# EasyEDA schematic SCH_REV1.3_2024-02-19.json
TITLE: Sheet_1; REV: 1.0; Date: 2024-02-18; Sheet: 1/1; Drawn By: liquid_soul; Company: Your Company
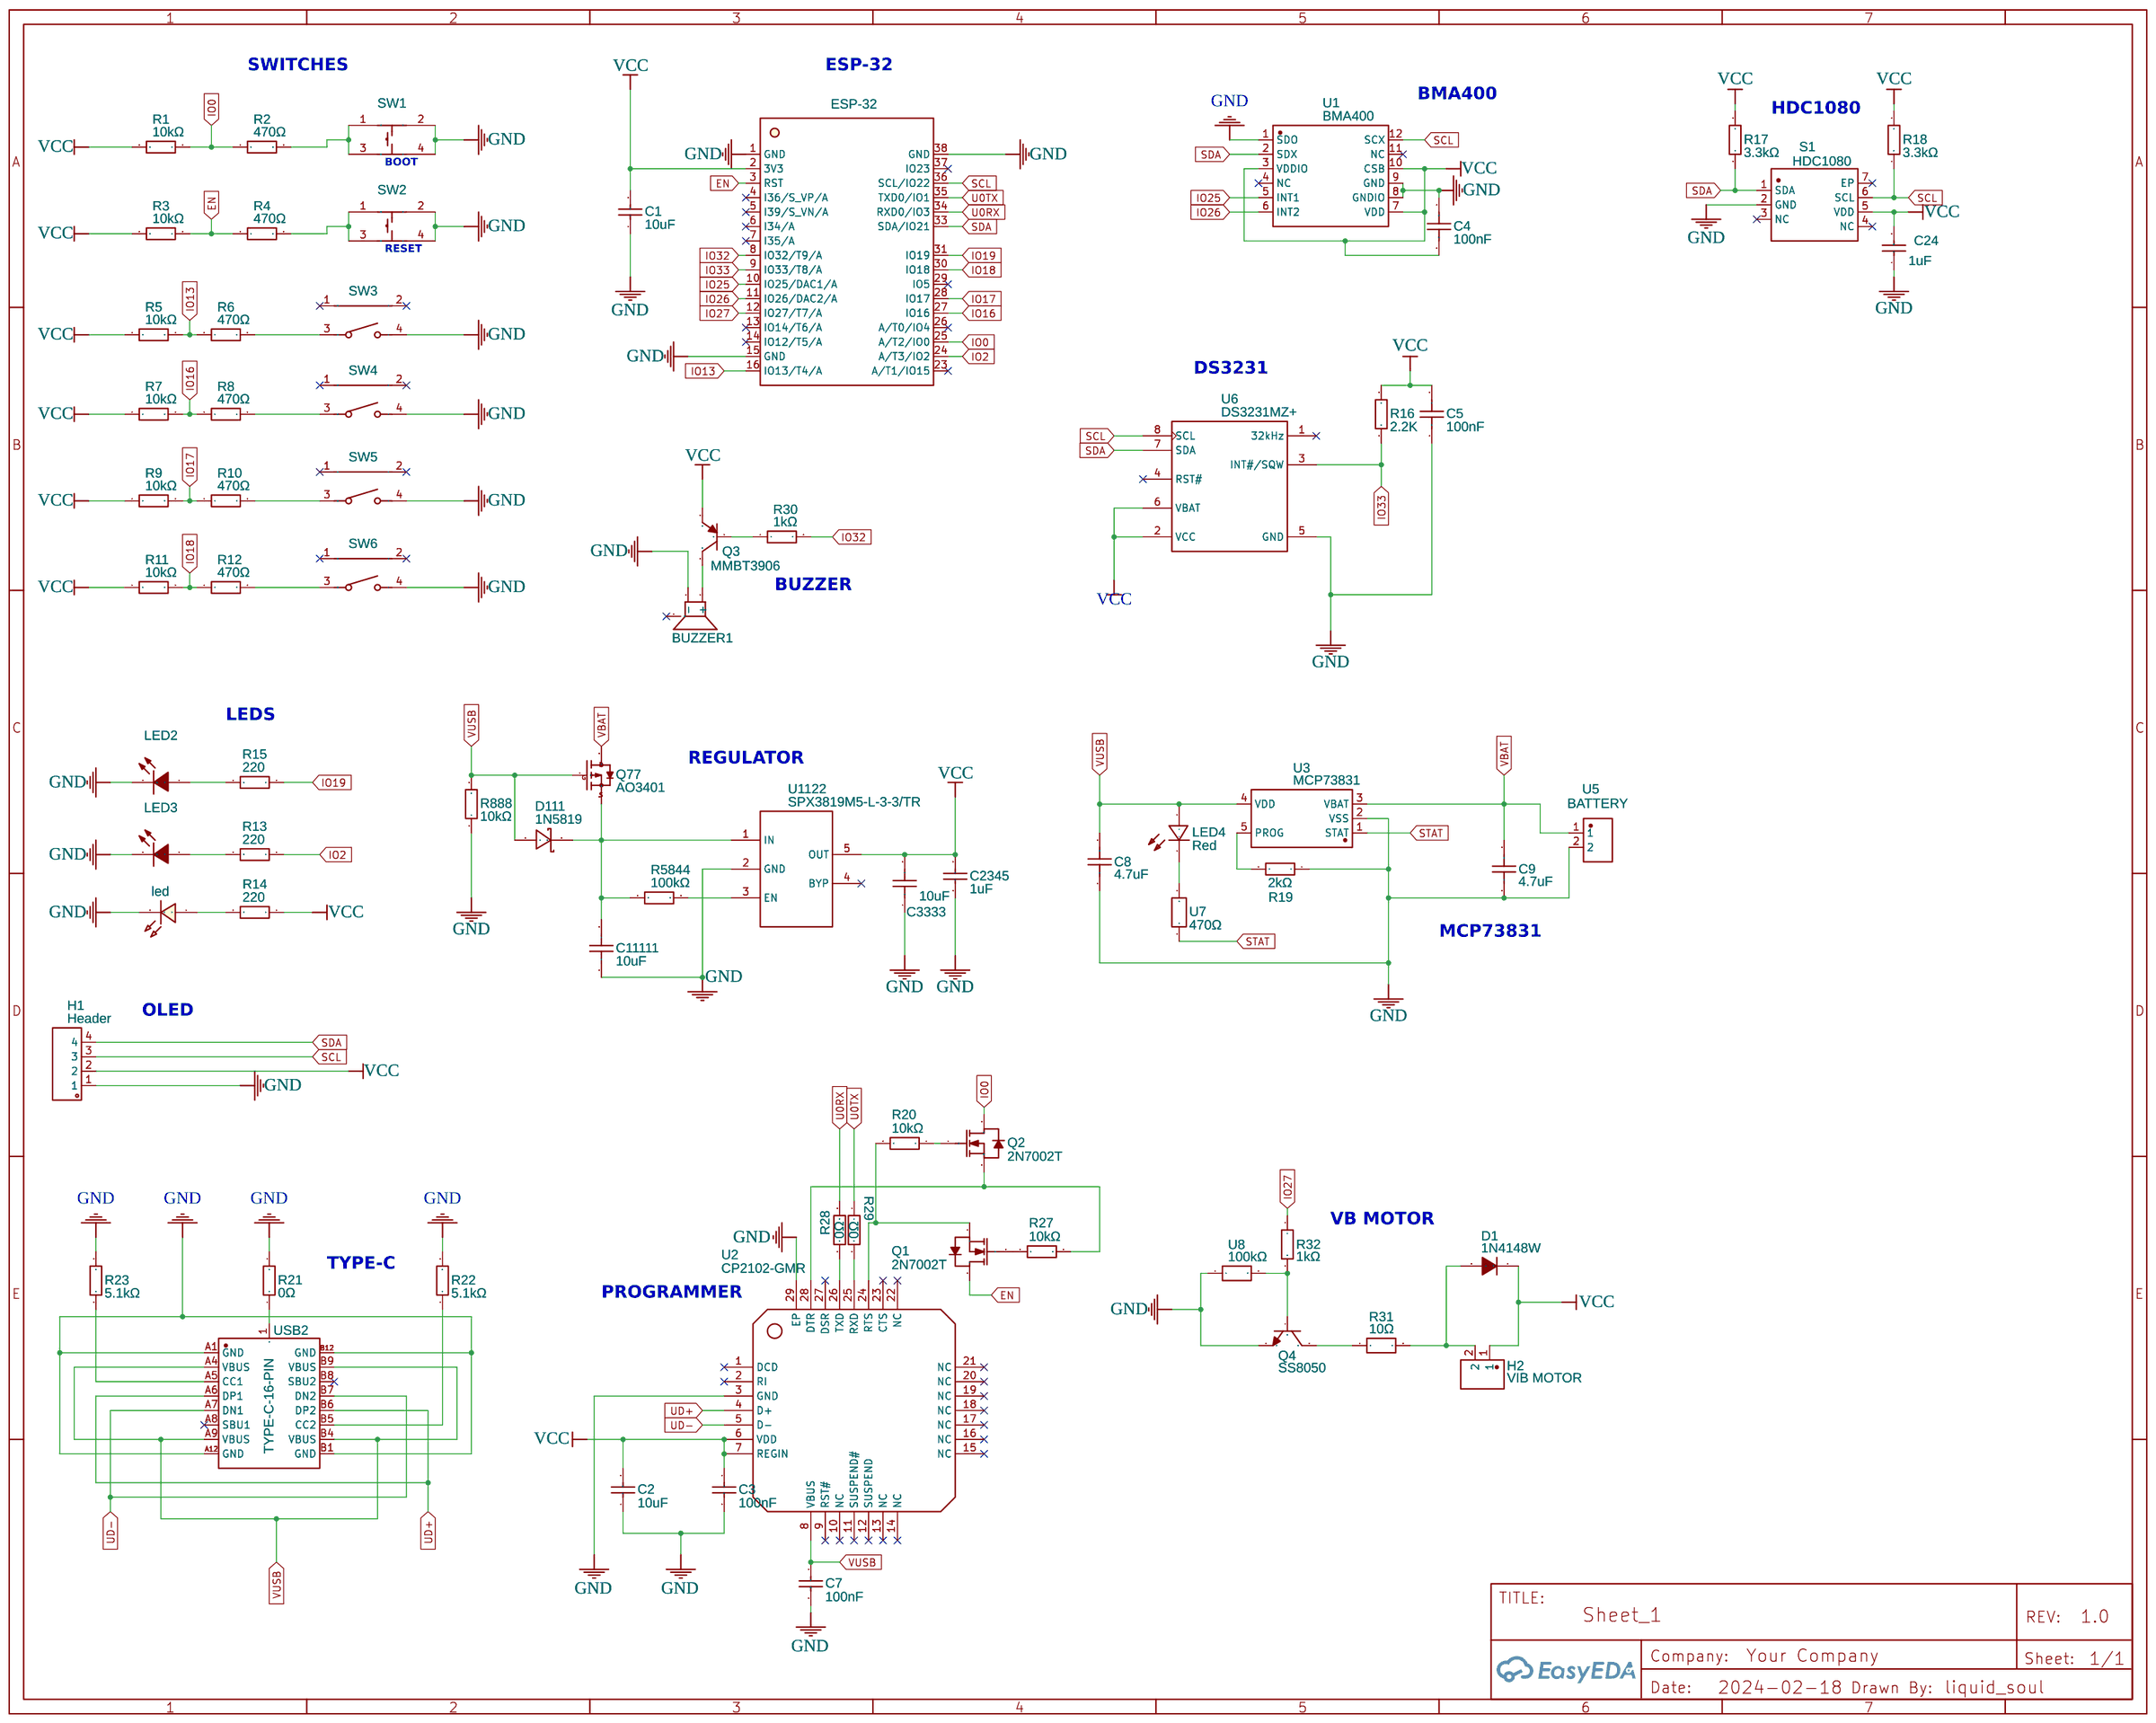
[diagram p0: schematic sheet]

## Parts
BUZZER1  4000Hz  [BUZ-SMD_3P-L5.2-W5.2-P3.50-BR]
C1  10uF  [C0603]
C2  10uF  [C0603]
C3  100nF  [C0603]
C4  100nF  [C0603]
C5  100nF  [C0603]
C7  100nF  [C0603]
C8  4.7uF  [C0603]
C9  4.7uF  [C0603]
C24  1uF  [C0603]
C2345  1uF  [C0603]
C3333  10uF  [C0603]
C11111  10uF  [C0603]
D1  1N4148W  [SOD-123_L2.8-W1.8-LS3.7-RD]
D111  1N5819  [SOD-123F_L2.8-W1.8-LS3.7-RD]
H1  Header  [HDR-TH_4P-P2.54-V-M]
H2  VIB MOTOR  [HDR-TH_2P-P2.54-V-M-1]
LED1  led  [LED0603_RED]
LED2  D-B060306B1-KS2  [LED0603-RD]
LED3  D-B060306B1-KS2  [LED0603-RD]
LED4  Red  [LED0603-RD]
Q1  2N7002T  [SOT-523-3_L1.6-W0.8-P0.50-LS1.6-BR]
Q2  2N7002T  [SOT-523-3_L1.6-W0.8-P0.50-LS1.6-BR]
Q3  MMBT3906  [SOT-23-3_L2.9-W1.4-P1.91-LS2.6-BR]
Q4  SS8050  [SOT-23-3_L2.9-W1.3-P1.90-LS2.4-BR]
Q77  AO3401  [SOT-23-3_L2.9-W1.3-P1.90-LS2.4-BR]
R1  10kΩ  [R0603]
R2  470Ω  [R0603]
R3  10kΩ  [R0603]
R4  470Ω  [R0603]
R5  10kΩ  [R0603]
R6  470Ω  [R0603]
R7  10kΩ  [R0603]
R8  470Ω  [R0603]
R9  10kΩ  [R0603]
R10  470Ω  [R0603]
R11  10kΩ  [R0603]
R12  470Ω  [R0603]
R13  220  [R0603]
R14  220  [R0603]
R15  220  [R0603]
R16  2.2K  [R0603]
R17  3.3kΩ  [R0603]
R18  3.3kΩ  [R0603]
R19  2kΩ  [R0603]
R20  10kΩ  [R0603]
R21  0Ω  [R0603]
R22  5.1kΩ  [R0603]
R23  5.1kΩ  [R0603]
R27  10kΩ  [R0603]
R28  0Ω  [R0603]
R29  0Ω  [R0603]
R30  1kΩ  [R0603]
R31  10Ω  [R0603]
R32  1kΩ  [R0603]
R888  10kΩ  [R0603]
R5844  100kΩ  [R0603]
S1  HDC1080  [SENSOR-SMD_HDC1080DMBR]
SW1  SKRPACE010  [KEY-SMD_4P-L4.2-W3.2-P2.20-LS4.6]
SW2  SKRPACE010  [KEY-SMD_4P-L4.2-W3.2-P2.20-LS4.6]
SW3  TS24CA  [SW-SMD_TS24CA]
SW4  TS24CA  [SW-SMD_TS24CA]
SW5  TS24CA  [SW-SMD_TS24CA]
SW6  TS24CA  [SW-SMD_TS24CA]
U1  BMA400  [LGA-12_L2.0-W2.0-P0.50-BL]
U2  CP2102-GMR  [WQFN-28_L5.0-W5.0-P0.50-BL-EP3.2]
U3  MCP73831  [SOT-23-5_L2.9-W1.6-P0.95-LS2.8-BL]
U4  ESP-32  [ESP-32]
U5  BATTERY  [HDR-TH_2P-P2.54-V-F]
U6  DS3231MZ+  [SOIC-8_L4.9-W3.9-P1.27-LS6.0-BL]
U7  470Ω  [R0603]
U8  100kΩ  [R0603]
U1122  SPX3819M5-L-3-3/TR  [SOT-23-5_L3.0-W1.7-P0.95-LS2.8-BR]
USB2  TYPE-C-16-PIN  [TYPE-C-SMD_TYPE-CF3.1]

## Library data of the parts
BUZZER1 = MLT-5030: Supplier: LCSC; Manufacturer: 华能; Supplier Part: C95297; JLCPCB Part Class: Extended Part
C1 C2 = 0603F106M160NT: Supplier: LCSC; Manufacturer: FH; Supplier Part: C48906; JLCPCB Part Class: Extended Part
C3 C7 = FN18X104K500PBG: Supplier: LCSC; Supplier Part: C235731; Manufacturer: Prosperity Dielectrics; Contributor: LCSC; JLCPCB Part Class: Extended Part
C4 C5 = 06033C104K4T2A: Contributor: LCSC; Supplier: LCSC; Supplier Part: C597114; Manufacturer: Kyocera AVX; JLCPCB Part Class: Extended Part
C8 C9 = CC0603KRX5R8BB475: Supplier: LCSC; Supplier Part: C326580; Manufacturer: YAGEO(国巨); Contributor: LCSC; JLCPCB Part Class: Extended Part
C24 C2345 = 0603B105K250NT: Supplier: LCSC; Manufacturer: FH; Supplier Part: C59302; JLCPCB Part Class: Extended Part
C3333 C11111 = 0603X106M250NT: Supplier: LCSC; Supplier Part: C479655; Manufacturer: FH(Guangdong Fenghua Advanced Tech); Contributor: LCSC; JLCPCB Part Class: Extended Part
D1 = 1N4148W-C84367: Supplier: LCSC; Manufacturer: MDD; Supplier Part: C84367; JLCPCB Part Class: Extended Part
D111 = 1N5819W: Supplier: LCSC; Supplier Part: C169540; Manufacturer: Shandong Jingdao Microelectronics; Contributor: LCSC; JLCPCB Part Class: Extended Part
H1 = Header-Male-2.54_1x4_C59481: Supplier: LCSC; Manufacturer: ReliaPro; Manufacturer Part: Headers  Pins 1*4P; Supplier Part: C59481
H2 = 77311-118-02LF: Contributor: LCSC; Supplier: LCSC; Supplier Part: C599036; Manufacturer: Amphenol; JLCPCB Part Class: Extended Part
LED1 = LED-0603_R: Manufacturer: EVERLIGHT(台湾亿光); Manufacturer Part: 19-217/R6C-AL1M2VY/3T; Supplier Part: C72044; Supplier: LCSC; Contributor: LCEDA_01
LED2 LED3 = D-B060306B1-KS2: Contributor: LCSC; Supplier: LCSC; Supplier Part: C118339; Manufacturer: ARKLED(方舟); Manufacturer Part: D-060306B1; JLCPCB Part Class: Extended Part
LED4 = E6Q0603URAC1UDA: Supplier: LCSC; Supplier Part: C375573; Manufacturer: ekinglux(亿晶源); Contributor: LCSC; JLCPCB Part Class: Extended Part
Q1 Q2 = K2N7002T-7-F: Supplier: LCSC; Supplier Part: C2904827; Manufacturer: KUU; Contributor: LCSC
Q3 = MMBT3906_C2891809: Contributor: LCSC; Supplier: LCSC; Supplier Part: C2891809; Manufacturer: YONGYUTAI(永裕泰); JLCPCB Part Class: Extended Part
Q4 = SS8050_C916392: Contributor: LCSC; Supplier: LCSC; Supplier Part: C916392; Manufacturer: JSMSEMI(杰盛微); JLCPCB Part Class: Extended Part
Q77 = AO3401: Supplier: LCSC; Manufacturer: Hottech; Contributor: LCSC; Supplier Part: C181091
R1 R3 R5 R7 R9 R11 R20 R27 = SY0603JN10KP: Supplier: LCSC; Supplier Part: C380762; Manufacturer: SANYEAR; Resistance (Ohms): 10K; Contributor: LCSC; JLCPCB Part Class: Extended Part
R2 R4 R6 R8 R10 R12 = QR0603F470RP05: Supplier: LCSC; Supplier Part: C176130; Manufacturer: Ever Ohms Tech; Resistance (Ohms): 470; Contributor: LCSC; JLCPCB Part Class: Extended Part
R13-R15 = AF0603FR-07220RL: Supplier: LCSC; Supplier Part: C144094; Manufacturer: YAGEO; Contributor: LCSC; JLCPCB Part Class: Extended Part; Resistance: 220Ω
R16 = RMC06032.2K1%N: Contributor: LCSC; Supplier: LCSC; Supplier Part: C325591; Manufacturer: Tyohm(幸亚电阻); JLCPCB Part Class: Extended Part
R17 R18 = RMC06033.3K5%N: Contributor: LCSC; Supplier: LCSC; Supplier Part: C269691; Manufacturer: Tyohm(幸亚电阻); JLCPCB Part Class: Extended Part
R19 = RMC06032K5%N: Supplier: LCSC; Supplier Part: C269690; Manufacturer: Tyohm(幸亚电阻); Manufacturer Part: RMC 0603 2K J N; Resistance (Ohms): 2K; Contributor: LCSC; JLCPCB Part Class: Extended Part
R21 R28 R29 = ETCR0603F0000K9: Supplier: LCSC; Supplier Part: C365490; Manufacturer: ResistorToday; Resistance (Ohms): 0; Contributor: LCSC; JLCPCB Part Class: Extended Part
R22 R23 = RMC06035.1K1%N: Supplier: LCSC; Supplier Part: C269716; Manufacturer: Tyohm; Resistance (Ohms): 5.1K; Contributor: LCSC; JLCPCB Part Class: Extended Part
R30 = 0603WAF1001T5E: Supplier: LCSC; Manufacturer: UNI-ROYAL(厚声); Supplier Part: C21190; JLCPCB Part Class: Basic Part
R31 = CR-03JL7---10R: Contributor: LCSC; Supplier: LCSC; Supplier Part: C217283; Manufacturer: Viking(光颉); JLCPCB Part Class: Extended Part
R32 = RMC06031K5%N: Contributor: LCSC; Supplier: LCSC; Supplier Part: C269685; Manufacturer: Tyohm(幸亚电阻); JLCPCB Part Class: Extended Part
R888 = RMC060310K1%N: Supplier: LCSC; Supplier Part: C269701; Manufacturer: Tyohm; Resistance (Ohms): 10K; Contributor: LCSC; JLCPCB Part Class: Extended Part
R5844 = RMC0603100K1%N: Supplier: LCSC; Supplier Part: C269699; Manufacturer: Tyohm; Resistance (Ohms): 100K; Contributor: LCSC; JLCPCB Part Class: Extended Part
S1 = HDC1080DMBR: Supplier: LCSC; Manufacturer: TI(德州仪器); Supplier Part: C82227; JLCPCB Part Class: Extended Part
SW1 SW2 = SKRPACE010: Contributor: LCSC; Supplier: LCSC; Manufacturer: ALPSALPINE(阿尔卑斯阿尔派); Supplier Part: C139797; JLCPCB Part Class: Extended Part
SW3-SW6 = TS24CA: Contributor: LCSC; Supplier: LCSC; Supplier Part: C393942; Manufacturer: SHOU HAN(首韩); JLCPCB Part Class: Extended Part
U1 = BMA400: Contributor: LCSC; Supplier: LCSC; Supplier Part: C437655; Manufacturer: Bosch(博世); JLCPCB Part Class: Extended Part
U2 = CP2102-GMR: Supplier: LCSC; Manufacturer: SILICON LABS; Supplier Part: C6568; JLCPCB Part Class: Basic Part
U3 = MCP73831T-2DCI/OT: Supplier: LCSC; Supplier Part: C625597; Manufacturer: MICROCHIP(美国微芯); Contributor: LCSC; JLCPCB Part Class: Extended Part
U4 = 安信可ESP-32S: Supplier: LCSC; Supplier Part: C82899; Manufacturer: Ai-Thinker; Manufacturer Part: ESP-32S; Contributor: Fangbrbr
U5 = KH-2.54FH-1X2P-H8.5: Supplier: LCSC; Supplier Part: C2905414; Manufacturer: kinghelm(金航标); Contributor: LCSC
U6 = DS3231MZ+: Supplier: LCSC; Manufacturer: ADI(亚德诺)/MAXIM(美信); Manufacturer Part: DS3231MZ+TRL; Supplier Part: C107410; JLCPCB Part Class: Extended Part
U7 = SCR0603F470R: Supplier: LCSC; Supplier Part: C5140094; Manufacturer: VO(翔胜); link: https://atta.szlcsc.com/upload/public/pdf/source/20220823/E5DDB4243192CD3C8AE9677163F934FF.pdf; Contributor: lcsc
U8 = SCR0603F100K: Contributor: lcsc; Supplier: LCSC; Supplier Part: C3016388; Manufacturer: VO(翔胜); JLCPCB Part Class: Extended Part
U1122 = SPX3819M5-L-3-3/TR: Supplier: LCSC; Manufacturer: EXAR; Supplier Part: C9055; JLCPCB Part Class: Extended Part
USB2 = TYPE-C-2.0-16PIN-SMT-3: Supplier: LCSC; Supplier Part: C2987386; Manufacturer: CIKI(皓富); Contributor: lcsc; JLCPCB Part Class: Extended Part

## Nets
GND: BUZZER1.3(-) C1.1 C2.1 C3.2 C4.1 C5.1 C7.2 C8.1 C9.1 C24.1 C2345.1 C3333.1 C11111.1 H1.1 LED1.2 LED2.1 LED3.1 Q4.2(E) R19.1 R21.2 R22.2 R23.2 R888.1 S1.2(GND) SW1.2 SW1.4 SW2.2 SW2.4 SW3.4 SW4.4 SW5.4 SW6.4 U1.1(SDO) U1.8(GNDIO) U1.9(GND) U2.3(GND) U2.29(EP) U3.2(VSS) U4.1(GND) U4.15(GND) U4.38(GND) U5.2 U6.5(GND) U8.1 U1122.2(GND) USB2.A1(GND) USB2.A12(GND) USB2.B1(GND) USB2.B12(GND)
VBAT: C9.2 Q77.3(D) U3.3(VBAT) U5.1
VCC: C1.2 C2.2 C3.1 C4.2 C5.2 C24.2 C2345.2 C3333.2 D1.1(C) H1.2 H2.1 Q3.2(E) R1.1 R3.1 R5.1 R7.1 R9.1 R11.1 R14.1 R16.2 R17.2 R18.2 S1.5(VDD) U1.3(VDDIO) U1.7(VDD) U1.10(CSB) U2.6(VDD) U2.7(REGIN) U4.2(3V3) U6.2(VCC) U6.6(VBAT) U1122.5(OUT)
EN: Q1.3(D) R3.2 R4.1 U4.3(RST)
IO0: Q2.3(D) R1.2 R2.1 U4.25(A/T2/IO0)
IO2: R13.1 U4.24(A/T3/IO2)
IO13: R5.2 R6.1 U4.16(IO13/T4/A)
IO16: R7.2 R8.1 U4.27(IO16)
IO17: R9.2 R10.1 U4.28(IO17)
IO18: R11.2 R12.1 U4.30(IO18)
IO19: R15.1 U4.31(IO19)
IO25: U1.5(INT1) U4.10(IO25/DAC1/A)
IO26: U1.6(INT2) U4.11(IO26/DAC2/A)
IO27: R32.1 U4.12(IO27/T7/A)
IO32: R30.2 U4.8(IO32/T9/A)
IO33: R16.1 U4.9(IO33/T8/A) U6.3(INT#/SQW)
SCL: H1.3 R18.1 S1.6(SCL) U1.12(SCX) U4.36(SCL/IO22) U6.8(SCL)
SDA: H1.4 R17.1 S1.1(SDA) U1.2(SDX) U4.33(SDA/IO21) U6.7(SDA)
STAT: U3.1(STAT) U7.1
U0RX: R28.2 U4.34(RXD0/IO3)
U0TX: R29.1 U4.35(TXD0/IO1)
UD+: U2.4(D+) USB2.A6(DP1) USB2.B6(DP2)
UD-: U2.5(D-) USB2.A7(DN1) USB2.B7(DN2)
VUSB: C7.1 C8.2 D111.2 LED4.2(+) Q77.1(G) R888.2 U2.8(VBUS) U3.4(VDD) USB2.A4(VBUS) USB2.A9(VBUS) USB2.B4(VBUS) USB2.B9(VBUS)
Net-(BUZZER1-2): BUZZER1.2(+) Q3.3(C)
Net-(C11111-2): C11111.2 D111.1 Q77.2(S) R5844.1 U1122.1(IN)
Net-(D1-2): D1.2(A) H2.2 R31.2
Net-(LED1-1): LED1.1 R14.2
Net-(LED2-2): LED2.2 R15.2
Net-(LED3-2): LED3.2 R13.2
Net-(LED4-1): LED4.1(-) U7.2
Net-(Q1-1): Q1.1(G) R27.2
Net-(Q1-2): Q1.2(S) R20.2 U2.24(RTS)
Net-(Q2-1): Q2.1(G) R20.1
Net-(Q2-2): Q2.2(S) R27.1 U2.28(DTR)
Net-(Q3-1): Q3.1(B) R30.1
Net-(Q4-1): Q4.1(B) R32.2 U8.2
Net-(Q4-3): Q4.3(C) R31.1
Net-(R2-2): R2.2 SW1.1 SW1.3
Net-(R4-2): R4.2 SW2.1 SW2.3
Net-(R6-2): R6.2 SW3.3
Net-(R8-2): R8.2 SW4.3
Net-(R10-2): R10.2 SW5.3
Net-(R12-2): R12.2 SW6.3
Net-(R19-2): R19.2 U3.5(PROG)
Net-(R21-1): R21.1 USB2.1(EH)
Net-(R22-1): R22.1 USB2.B5(CC2)
Net-(R23-1): R23.1 USB2.A5(CC1)
Net-(R28-1): R28.1 U2.26(TXD)
Net-(R29-2): R29.2 U2.25(RXD)
Net-(R5844-2): R5844.2 U1122.3(EN)

Not connected (* = marked no-connect by the designer): BUZZER1 1(NC)*; S1 3(NC)* 4(NC)* 7(EP)*; SW3 1* 2*; SW4 1* 2*; SW5 1* 2*; SW6 1* 2*; U1 4(NC)* 11(NC)*; U2 1(DCD)* 2(RI)* 9(RST#)* 10(NC)* 11(SUSPEND#)* 12(SUSPEND)* 13(NC)* 14(NC)* 15(NC)* 16(NC)* 17(NC)* 18(NC)* 19(NC)* 20(NC)* 21(NC)* 22(NC)* 23(CTS)* 27(DSR)*; U4 4(I36/S_VP/A)* 5(I39/S_VN/A)* 6(I34/A)* 7(I35/A)* 13(IO14/T6/A)* 14(IO12/T5/A)* 23(A/T1/IO15)* 26(A/T0/IO4)* 29(IO5)* 37(IO23)*; U6 1(32kHz)* 4(RST#)*; U1122 4(BYP)*; USB2 A8(SBU1)* B8(SBU2)*

## Notes on the sheet
- SWITCHES
- ESP-32
- BMA400
- HDC1080
- BOOT
- RESET
- DS3231
- BUZZER
- LEDS
- REGULATOR
- MCP73831
- OLED
- VB MOTOR
- TYPE-C
- PROGRAMMER
